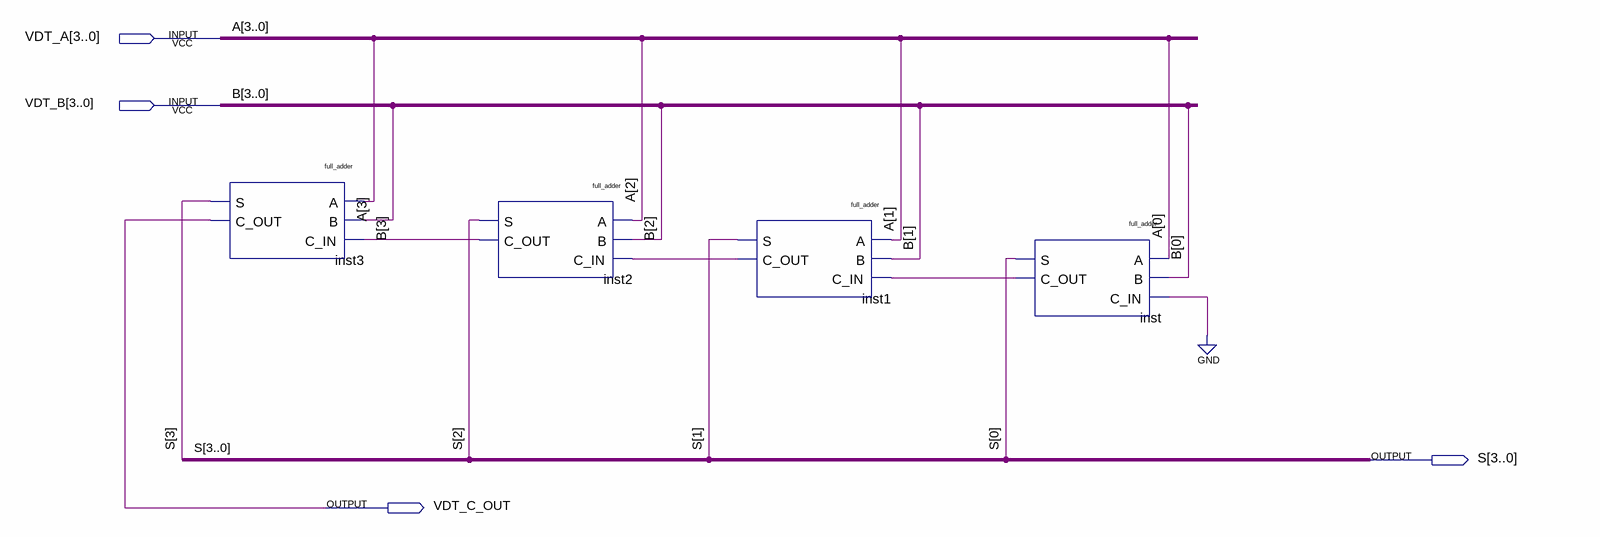
[diagram p0: schematic sheet]
// Quartus schematic Assignment1.bdf as structural Verilog: 4 symbols, 4 pins
module Assignment1 (
  input  [3:0] VDT_A,
  input  [3:0] VDT_B,
  output [3:0] S,
  output VDT_C_OUT
);

  wire inst1_c_out, inst2_c_out, inst_c_out;

  full_adder inst3 (.A(VDT_A[3]), .B(VDT_B[3]), .C_IN(inst2_c_out), .S(S[3]), .C_OUT(VDT_C_OUT));
  full_adder inst2 (.A(VDT_A[2]), .B(VDT_B[2]), .C_IN(inst1_c_out), .S(S[2]), .C_OUT(inst2_c_out));
  full_adder inst1 (.A(VDT_A[1]), .B(VDT_B[1]), .C_IN(inst_c_out), .S(S[1]), .C_OUT(inst1_c_out));
  full_adder inst (.A(VDT_A[0]), .B(VDT_B[0]), .C_IN(1'b0), .S(S[0]), .C_OUT(inst_c_out));

  // Other names for the same wires on the sheet: A[3:0] = VDT_A; B[3:0] = VDT_B
endmodule
